# Altium project PCB_Project.PrjPcb
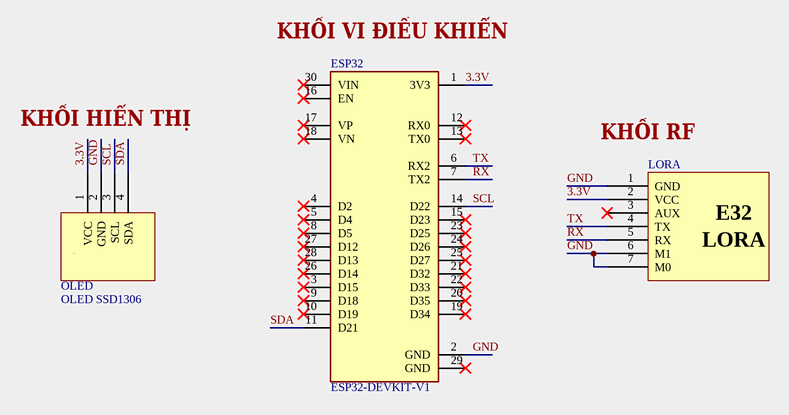
[diagram p0: Gateway.SchDoc]
1 sheet, 3 parts. Net scope: global (net labels, ports and power ports of the same name join across sheets).
Board file: PCB1.PcbDoc

## Sheet Gateway.SchDoc
size A4; SheetNumber: 1; SheetTotal: 1

### Parts
ESP32  ESP32-DEVKIT-V1  [MODULE_ESP32_DEVKIT_V1]
LORA  (no value)  [LORA-E32]
OLED  OLED SSD1306  [SSD1306]

### Nets
3.3V: ESP32.1(3V3) LORA.2(VCC) OLED.1(VCC)
GND: ESP32.2(GND) LORA.1(GND) LORA.6(M1) LORA.7(M0) OLED.2(GND)
RX: ESP32.7(TX2) LORA.5(RX)
SCL: ESP32.14(D22) OLED.3(SCL)
SDA: ESP32.11(D21) OLED.4(SDA)
TX: ESP32.6(RX2) LORA.4(TX)

Not connected (* = marked no-connect by the designer): ESP32 3(D15)* 4(D2)* 5(D4)* 8(D5)* 9(D18)* 10(D19)* 12(RX0)* 13(TX0)* 15(D23)* 16(EN)* 17(VP)* 18(VN)* 19(D34)* 20(D35)* 21(D32)* 22(D33)* 23(D25)* 24(D26)* 25(D27)* 26(D14)* 27(D12)* 28(D13)* 29(GND)* 30(VIN)*; LORA 3(AUX)*

### Notes on the sheet
- (near ESP32) KHỐI VI ĐIỀU KHIỂN
- KHỐI HIỂN THỊ
- (near LORA) KHỐI RF
- Title
- Size:
- Date:
- Author:
- A4
- Time:
- Number:
- Checked:
- Revision:
- Sheet
- Approved:
- of
- File:
- (in symbol LORA-E32) E32

### Library data of the parts
ESP32 = ESP32-DEVKIT-V1: Dual core, Wi-Fi: 2.4 GHz up to 150 Mbits/s,BLE (Bluetooth Low Energy) and legacy Bluetooth, 32 bits, Up to 240 MHz; MF: Do it; SnapEDA_Link: https://www.snapeda.com/parts/ESP32-DEVKIT-V1/Do+it/view-part/?ref=snap; Package: None; Value: *; MP: ESP32-DEVKIT-V1; Check_prices: https://www.snapeda.com/parts/ESP32-DEVKIT-V1/Do+it/view-part/?ref=eda
LORA = LORA-E32: Design By @Alixahedi
OLED = SSD1306